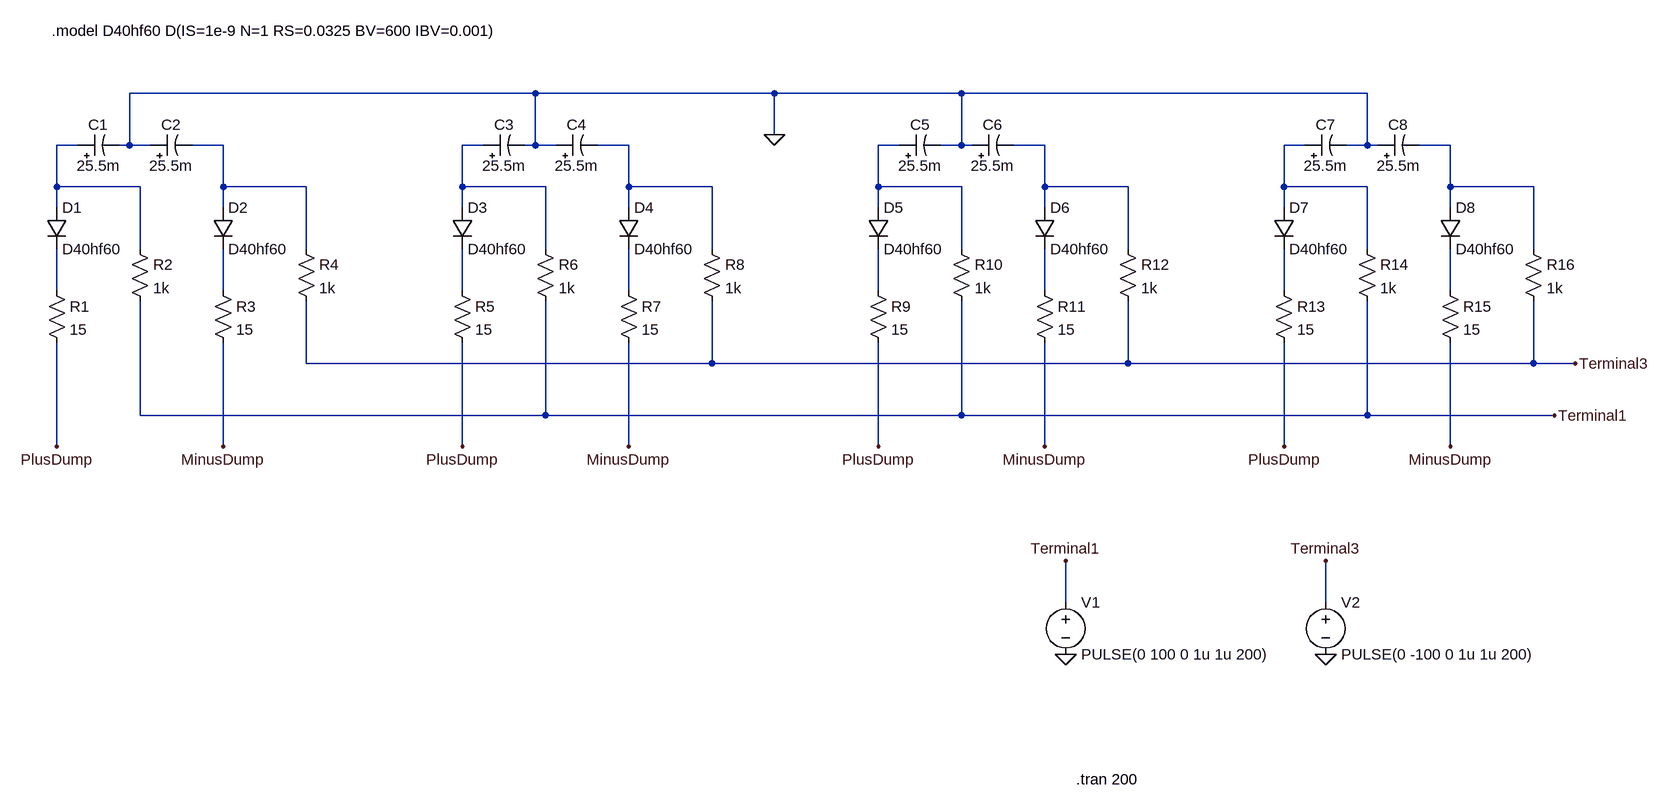
[diagram p0: schematic CapBank1_17CapSide_Simplified.asc]
CapBank1_17CapSide_Simplified.asc, the LTspice schematic file:
Version 4
SHEET 1 2520 1248
WIRE 800 176 176 176
WIRE 1168 176 800 176
WIRE 1456 176 1168 176
WIRE 2080 176 1456 176
WIRE 1168 240 1168 176
WIRE 96 256 64 256
WIRE 176 256 176 176
WIRE 176 256 160 256
WIRE 208 256 176 256
WIRE 320 256 272 256
WIRE 720 256 688 256
WIRE 800 256 800 176
WIRE 800 256 784 256
WIRE 832 256 800 256
WIRE 944 256 896 256
WIRE 1360 256 1328 256
WIRE 1456 256 1456 176
WIRE 1456 256 1424 256
WIRE 1472 256 1456 256
WIRE 1584 256 1536 256
WIRE 1984 256 1952 256
WIRE 2080 256 2080 176
WIRE 2080 256 2048 256
WIRE 2096 256 2080 256
WIRE 2208 256 2160 256
WIRE 64 320 64 256
WIRE 192 320 64 320
WIRE 320 320 320 256
WIRE 448 320 320 320
WIRE 688 320 688 256
WIRE 816 320 688 320
WIRE 944 320 944 256
WIRE 1072 320 944 320
WIRE 1328 320 1328 256
WIRE 1456 320 1328 320
WIRE 1584 320 1584 256
WIRE 1712 320 1584 320
WIRE 1952 320 1952 256
WIRE 2080 320 1952 320
WIRE 2208 320 2208 256
WIRE 2336 320 2208 320
WIRE 64 352 64 320
WIRE 320 352 320 320
WIRE 688 352 688 320
WIRE 944 352 944 320
WIRE 1328 352 1328 320
WIRE 1584 352 1584 320
WIRE 1952 352 1952 320
WIRE 2208 352 2208 320
WIRE 192 416 192 320
WIRE 448 416 448 320
WIRE 816 416 816 320
WIRE 1072 416 1072 320
WIRE 1456 416 1456 320
WIRE 1712 416 1712 320
WIRE 2080 416 2080 320
WIRE 2336 416 2336 320
WIRE 64 480 64 416
WIRE 320 480 320 416
WIRE 688 480 688 416
WIRE 944 480 944 416
WIRE 1328 480 1328 416
WIRE 1584 480 1584 416
WIRE 1952 480 1952 416
WIRE 2208 480 2208 416
WIRE 448 592 448 496
WIRE 1072 592 1072 496
WIRE 1072 592 448 592
WIRE 1712 592 1712 496
WIRE 1712 592 1072 592
WIRE 2336 592 2336 496
WIRE 2336 592 1712 592
WIRE 2400 592 2336 592
WIRE 192 672 192 496
WIRE 816 672 816 496
WIRE 816 672 192 672
WIRE 1456 672 1456 496
WIRE 1456 672 816 672
WIRE 2080 672 2080 496
WIRE 2080 672 1456 672
WIRE 2368 672 2080 672
WIRE 64 720 64 560
WIRE 320 720 320 560
WIRE 688 720 688 560
WIRE 944 720 944 560
WIRE 1328 720 1328 560
WIRE 1584 720 1584 560
WIRE 1952 720 1952 560
WIRE 2208 720 2208 560
WIRE 1616 960 1616 896
WIRE 2016 960 2016 896
FLAG 1168 240 0
FLAG 2400 592 Terminal3
FLAG 2368 672 Terminal1
FLAG 1616 1040 0
FLAG 1616 896 Terminal1
FLAG 2016 1040 0
FLAG 2016 896 Terminal3
FLAG 64 720 PlusDump
FLAG 688 720 PlusDump
FLAG 1328 720 PlusDump
FLAG 1952 720 PlusDump
FLAG 320 720 MinusDump
FLAG 944 720 MinusDump
FLAG 1584 720 MinusDump
FLAG 2208 720 MinusDump
SYMBOL polcap 96 272 R270
WINDOW 0 32 32 VTop 2
WINDOW 3 0 32 VBottom 2
SYMATTR InstName C1
SYMATTR Value 25.5m
SYMBOL polcap 208 272 R270
WINDOW 0 32 32 VTop 2
WINDOW 3 0 32 VBottom 2
SYMATTR InstName C2
SYMATTR Value 25.5m
SYMBOL Diode 48 352 R0
SYMATTR InstName D1
SYMATTR Value D40hf60
SYMBOL Res 48 464 R0
SYMATTR InstName R1
SYMATTR Value 15
SYMBOL Res 176 400 R0
SYMATTR InstName R2
SYMATTR Value 1k
SYMBOL Diode 304 352 R0
SYMATTR InstName D2
SYMATTR Value D40hf60
SYMBOL Res 304 464 R0
SYMATTR InstName R3
SYMATTR Value 15
SYMBOL Res 432 400 R0
SYMATTR InstName R4
SYMATTR Value 1k
SYMBOL polcap 720 272 R270
WINDOW 0 32 32 VTop 2
WINDOW 3 0 32 VBottom 2
SYMATTR InstName C3
SYMATTR Value 25.5m
SYMBOL polcap 832 272 R270
WINDOW 0 32 32 VTop 2
WINDOW 3 0 32 VBottom 2
SYMATTR InstName C4
SYMATTR Value 25.5m
SYMBOL Diode 672 352 R0
SYMATTR InstName D3
SYMATTR Value D40hf60
SYMBOL Res 672 464 R0
SYMATTR InstName R5
SYMATTR Value 15
SYMBOL Res 800 400 R0
SYMATTR InstName R6
SYMATTR Value 1k
SYMBOL Diode 928 352 R0
SYMATTR InstName D4
SYMATTR Value D40hf60
SYMBOL Res 928 464 R0
SYMATTR InstName R7
SYMATTR Value 15
SYMBOL Res 1056 400 R0
SYMATTR InstName R8
SYMATTR Value 1k
SYMBOL polcap 1360 272 R270
WINDOW 0 32 32 VTop 2
WINDOW 3 0 32 VBottom 2
SYMATTR InstName C5
SYMATTR Value 25.5m
SYMBOL polcap 1472 272 R270
WINDOW 0 32 32 VTop 2
WINDOW 3 0 32 VBottom 2
SYMATTR InstName C6
SYMATTR Value 25.5m
SYMBOL Diode 1312 352 R0
SYMATTR InstName D5
SYMATTR Value D40hf60
SYMBOL Res 1312 464 R0
SYMATTR InstName R9
SYMATTR Value 15
SYMBOL Res 1440 400 R0
SYMATTR InstName R10
SYMATTR Value 1k
SYMBOL Diode 1568 352 R0
SYMATTR InstName D6
SYMATTR Value D40hf60
SYMBOL Res 1568 464 R0
SYMATTR InstName R11
SYMATTR Value 15
SYMBOL Res 1696 400 R0
SYMATTR InstName R12
SYMATTR Value 1k
SYMBOL polcap 1984 272 R270
WINDOW 0 32 32 VTop 2
WINDOW 3 0 32 VBottom 2
SYMATTR InstName C7
SYMATTR Value 25.5m
SYMBOL polcap 2096 272 R270
WINDOW 0 32 32 VTop 2
WINDOW 3 0 32 VBottom 2
SYMATTR InstName C8
SYMATTR Value 25.5m
SYMBOL Diode 1936 352 R0
SYMATTR InstName D7
SYMATTR Value D40hf60
SYMBOL Res 1936 464 R0
SYMATTR InstName R13
SYMATTR Value 15
SYMBOL Res 2064 400 R0
SYMATTR InstName R14
SYMATTR Value 1k
SYMBOL Diode 2192 352 R0
SYMATTR InstName D8
SYMATTR Value D40hf60
SYMBOL Res 2192 464 R0
SYMATTR InstName R15
SYMATTR Value 15
SYMBOL Res 2320 400 R0
SYMATTR InstName R16
SYMATTR Value 1k
SYMBOL Voltage 1616 944 R0
SYMATTR InstName V1
SYMATTR Value PULSE(0 100 0 1u 1u 200)
SYMBOL Voltage 2016 944 R0
SYMATTR InstName V2
SYMATTR Value PULSE(0 -100 0 1u 1u 200)
TEXT 56 80 Left 2 !.model D40hf60 D(IS=1e-9 N=1 RS=0.0325 BV=600 IBV=0.001)
TEXT 1632 1232 Left 2 !.tran 200

The netlist it stands for:
* CapBank1_17CapSide_Simplified.asc
C1 N001 0 25.5m
C2 0 N002 25.5m
D1 N001 N009 D40hf60
R1 N009 PlusDump 15
R2 N001 Terminal1 1k
D2 N002 N010 D40hf60
R3 N010 MinusDump 15
R4 N002 Terminal3 1k
C3 N003 0 25.5m
C4 0 N004 25.5m
D3 N003 N011 D40hf60
R5 N011 PlusDump 15
R6 N003 Terminal1 1k
D4 N004 N012 D40hf60
R7 N012 MinusDump 15
R8 N004 Terminal3 1k
C5 N005 0 25.5m
C6 0 N006 25.5m
D5 N005 N013 D40hf60
R9 N013 PlusDump 15
R10 N005 Terminal1 1k
D6 N006 N014 D40hf60
R11 N014 MinusDump 15
R12 N006 Terminal3 1k
C7 N007 0 25.5m
C8 0 N008 25.5m
D7 N007 N015 D40hf60
R13 N015 PlusDump 15
R14 N007 Terminal1 1k
D8 N008 N016 D40hf60
R15 N016 MinusDump 15
R16 N008 Terminal3 1k
V1 Terminal1 0 PULSE(0 100 0 1u 1u 200)
V2 Terminal3 0 PULSE(0 -100 0 1u 1u 200)
.model D D
.lib standard.dio
.model D40hf60 D(IS=1e-9 N=1 RS=0.0325 BV=600 IBV=0.001)
.tran 200
.backanno
.end